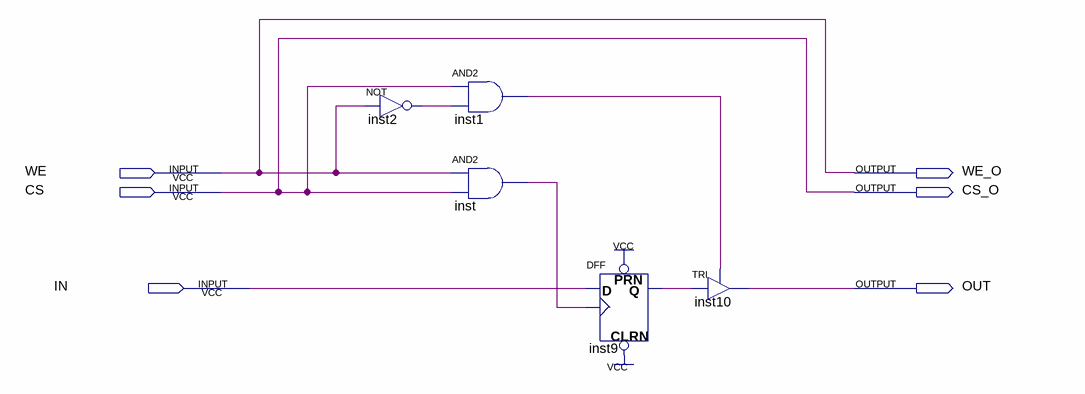
[diagram p0: schematic sheet]
// Quartus schematic Cell_1_bit.bdf as structural Verilog: 5 symbols, 6 pins
module Cell_1_bit (
  input  WE,
  input  CS,
  input  IN,
  output WE_O,
  output CS_O,
  output OUT
);

  wire inst1_out, inst2_out, inst9_q, inst_out;

  not inst2 (inst2_out, WE);
  and inst1 (inst1_out, CS, inst2_out);
  and inst (inst_out, WE, CS);
  DFF inst9 (.CLRN(1'b1), .CLK(inst_out), .D(IN), .PRN(1'b1), .Q(inst9_q));
  TRI inst10 (.IN(inst9_q), .OE(inst1_out), .OUT(OUT));

  assign CS_O = CS;
  assign WE_O = WE;
endmodule
